# Altium schematic sheet optics.SchDoc
size A4
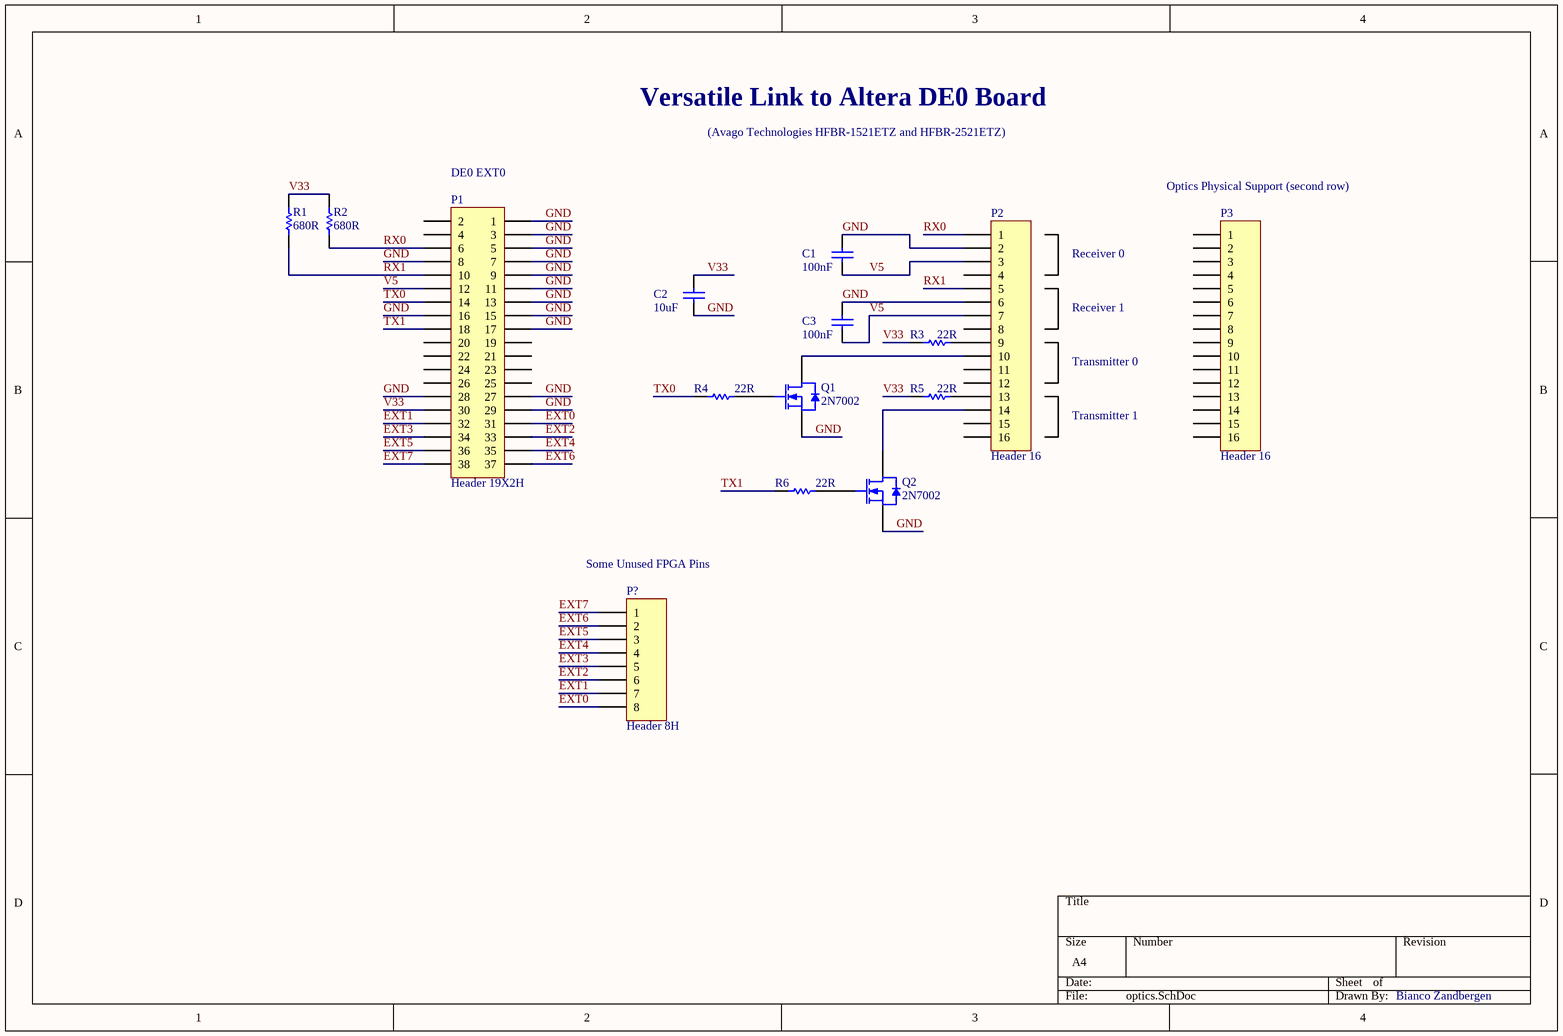
[diagram p0: optics.SchDoc]

## Parts
C1  value 100nF  [2012[0805]_CAP]  (hidden comment: Cap)
C2  value 10uF  [2012[0805]_CAP]  (hidden comment: Cap)
C3  value 100nF  [2012[0805]_CAP]  (hidden comment: Cap)
P1  Header 19X2H  [HDR2X19H]
P2  Header 16  [HDR1X16]
P3  Header 16  [HDR1X16]
P?  Header 8H  [HDR1X8H]
Q1  2N7002  [SOT23_M]
Q2  2N7002  [SOT23_M]
R1  value 680R  [RES24.1-19X7.4]  (hidden comment: Res1)
R2  value 680R  [RES30.6-25.5X9]  (hidden comment: Res1)
R3  value 22R  [2012[0805]_RES]  (hidden comment: Res1)
R4  value 22R  [2012[0805]_RES]  (hidden comment: Res1)
R5  value 22R  [2012[0805]_RES]  (hidden comment: Res1)
R6  value 22R  [2012[0805]_RES]  (hidden comment: Res1)

## Nets
EXT0: P1.31 P?.8
EXT1: P1.32 P?.7
EXT2: P1.33 P?.6
EXT3: P1.34 P?.5
EXT4: P1.35 P?.4
EXT5: P1.36 P?.3
EXT6: P1.37 P?.2
EXT7: P1.38 P?.1
GND: C1.2 C2.1 C3.2 P1.1 P1.3 P1.5 P1.7 P1.8 P1.9 P1.11 P1.13 P1.15 P1.16 P1.17 P1.27 P1.28 P1.29 P2.2 P2.6 Q1.2(S) Q2.2(S)
RX0: P1.6 P2.1 R2.1
RX1: P1.10 P2.5 R1.1
TX0: P1.14 R4.1
TX1: P1.18 R6.1
V5: C1.1 C3.1 P1.12 P2.3 P2.7
V33: C2.2 P1.30 R1.2 R2.2 R3.1 R5.1
NetP2_9: P2.9 R3.2
NetP2_10: P2.10 Q1.3(D)
NetP2_13: P2.13 R5.2
NetP2_14: P2.14 Q2.3(D)
NetQ1_1: Q1.1(G) R4.2
NetQ2_1: Q2.1(G) R6.2

Not connected (* = marked no-connect by the designer): P1 2 4 19 20 21 22 23 24 25 26; P2 4 8 11 12 15 16; P3 1 2 3 4 5 6 7 8 9 10 11 12 13 14 15 16

## Notes on the sheet
- Versatile Link to Altera DE0 Board
- (near P1) DE0 EXT0
- (Avago Technologies HFBR-1521ETZ and HFBR-2521ETZ)
- (near P3) Optics Physical Support (second row)
- Receiver 0
- Receiver 1
- Transmitter 0
- Transmitter 1
- (near P?) Some Unused FPGA Pins
- Bianco Zandbergen

## Library data of the parts
C1-C3 = Cap: Capacitor; Published: 8-Jun-2000; LatestRevisionDate: 17-Jul-2002; LatestRevisionNote: Re-released for DXP Platform.; PackageReference: RAD-0.3; Publisher: Altium Limited
P1 = Header 19X2H: Header, 19-Pin, Dual row, Right Angle; LatestRevisionDate: 17-Jul-2002; LatestRevisionNote: Re-released for DXP Platform.; Publisher: Altium Limited
P2 P3 = Header 16: Header, 16-Pin; LatestRevisionDate: 17-Jul-2002; LatestRevisionNote: Re-released for DXP Platform.; Publisher: Altium Limited
P? = Header 8H: Header, 8-Pin, Right Angle; LatestRevisionDate: 17-Jul-2002; LatestRevisionNote: Re-released for DXP Platform.; Publisher: Altium Limited
Q1 Q2 = 2N7002: N-channel Enhancement Mode Field-effect Transistor; Published: 17-Sep-2003; LatestRevisionDate: 12-Dec-2006; LatestRevisionNote: IPC-7351 Footprint Added.; DatasheetVersion: 27-Jul-2000; PackageVersion: May-1999; PackageReference: SOT23; Publisher: Altium Limited; PackageDescription: 3-Pin SOT-23 Package 0.95 mm Pitch, 2.3 mm Lead Span; ComponentLink1Description: Manufacturer Link; ComponentLink1URL: http://www.semiconductors.philips.com/; ComponentLink2Description: Datasheet; ComponentLink2URL: http://www.semiconductors.philips.com/acrobat/datasheets/2N7002_4.pdf
R1-R6 = Res1: Resistor; Published: 8-Jun-2000; LatestRevisionDate: 17-Jul-2002; LatestRevisionNote: Re-released for DXP Platform.; PackageReference: AXIAL-0.3; Publisher: Altium Limited